# Altium schematic sheet PVDF_Drone.SchDoc
size A3; SheetNumber: 1; SheetTotal: 1
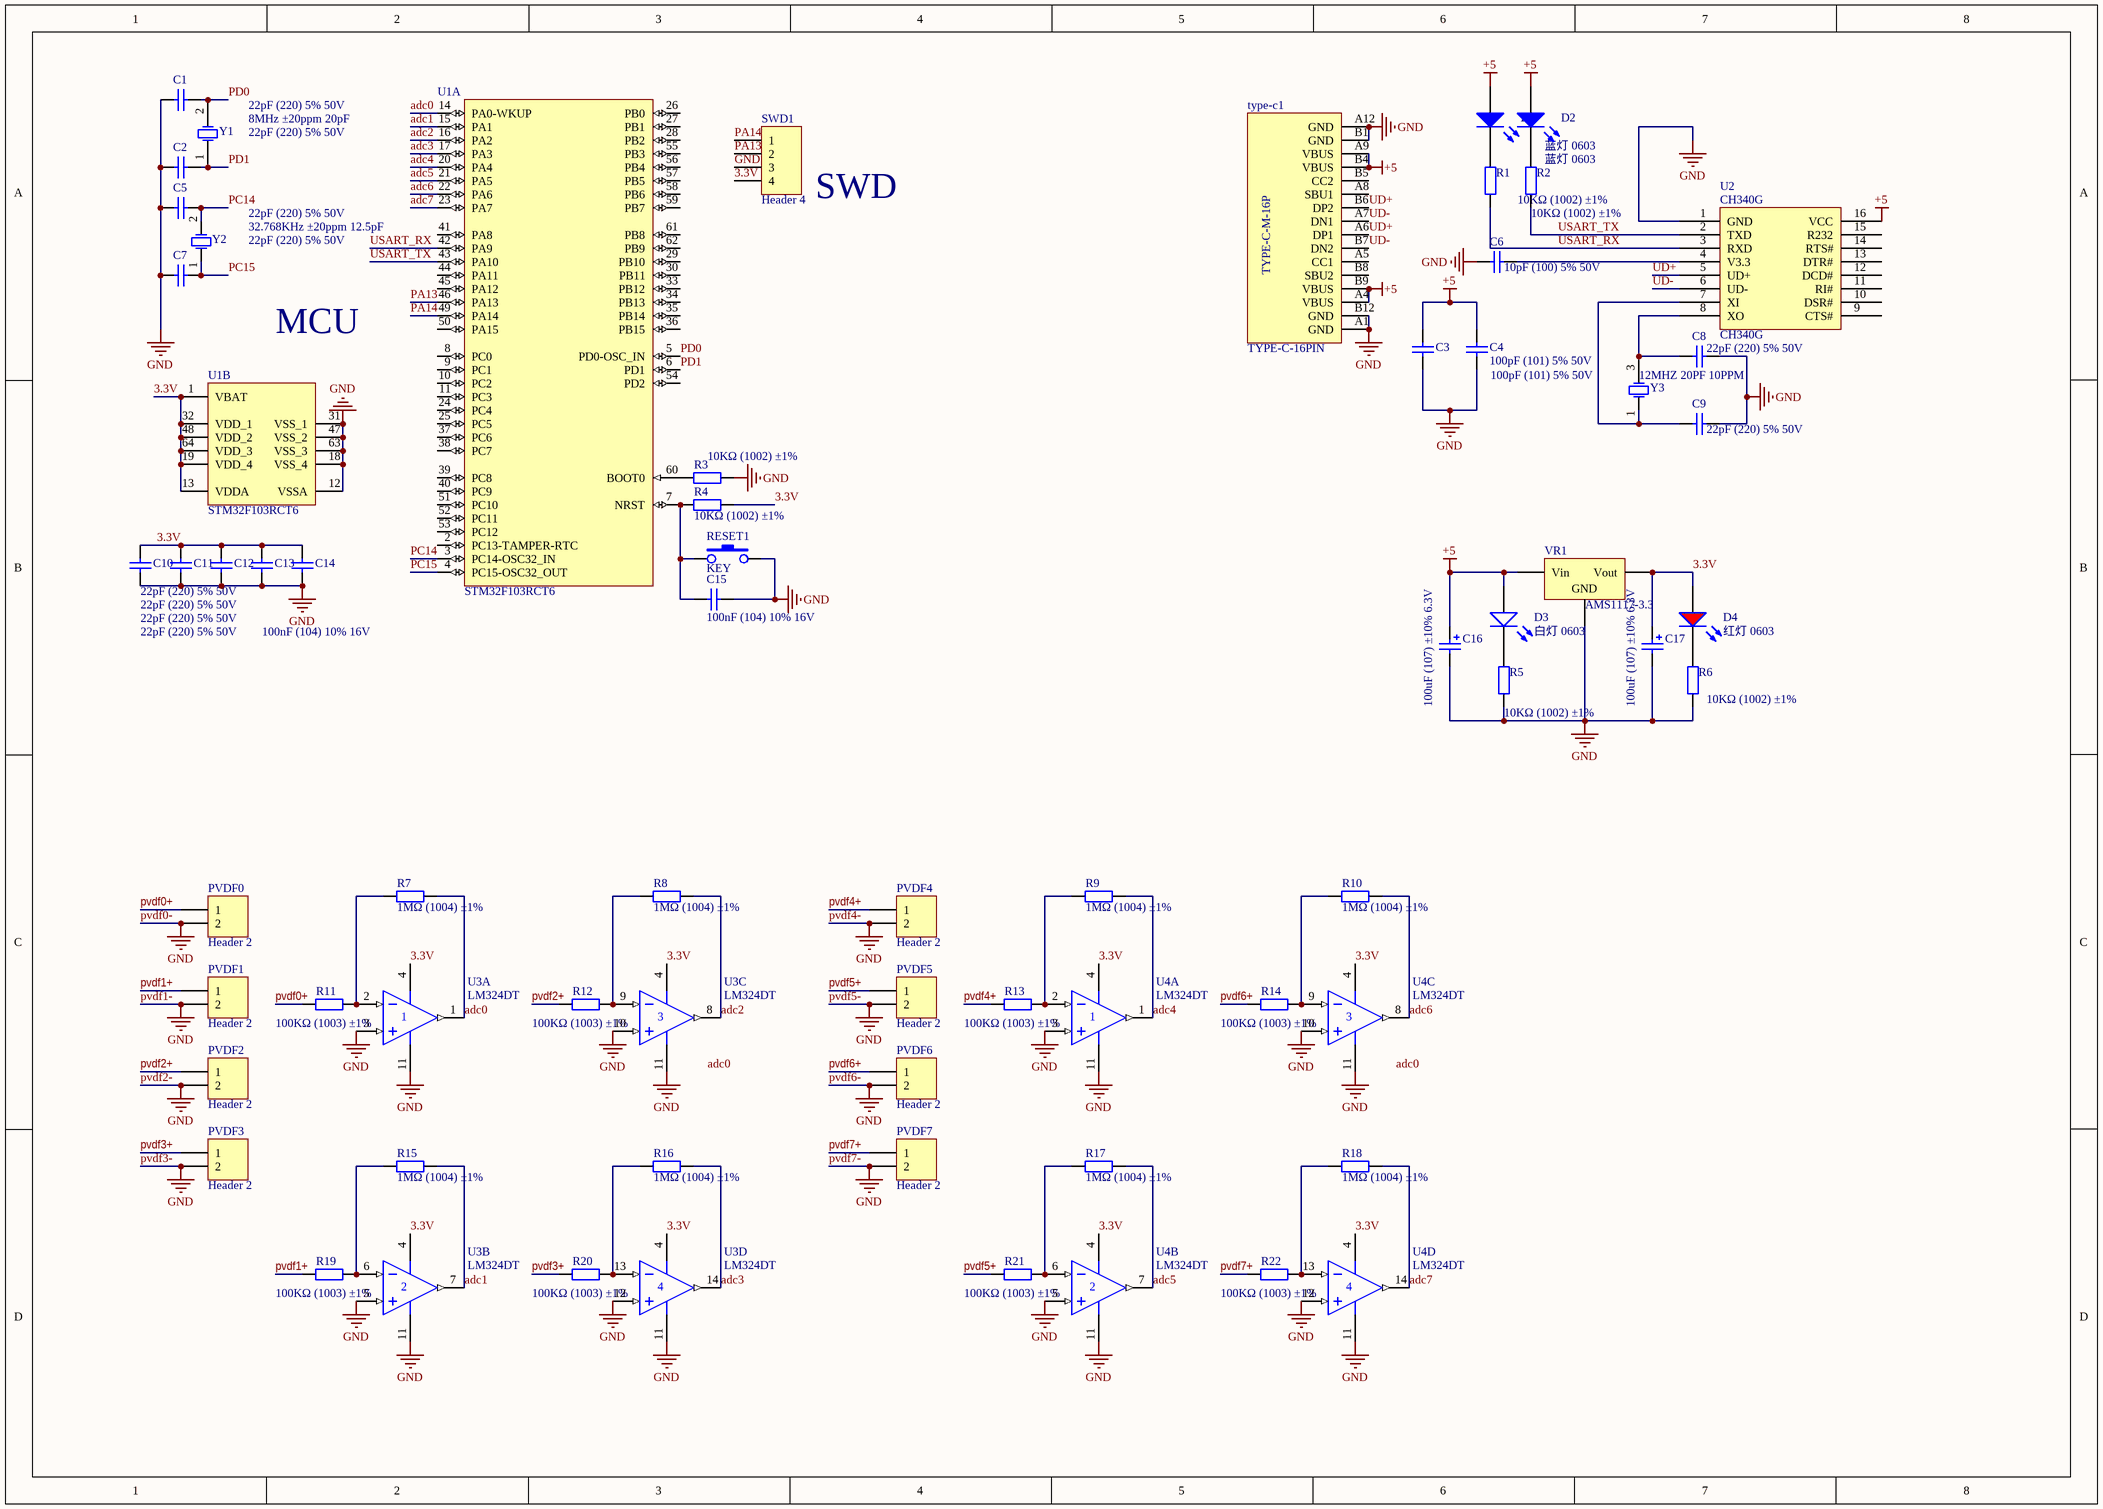
[diagram p0: PVDF_Drone.SchDoc]

## Parts
C1  22pF (220) 5% 50V  [0402_C]
C2  22pF (220) 5% 50V  [0402_C]
C3  100pF (101) 5% 50V  [0402_C]
C4  100pF (101) 5% 50V  [0402_C]
C5  22pF (220) 5% 50V  [0402_C]
C6  10pF (100) 5% 50V  [0402_C]
C7  22pF (220) 5% 50V  [0402_C]
C8  22pF (220) 5% 50V  [0402_C]
C9  22pF (220) 5% 50V  [0402_C]
C10  100nF (104) 10% 16V  [0402_C]
C11  22pF (220) 5% 50V  [0402_C]
C12  22pF (220) 5% 50V  [0402_C]
C13  22pF (220) 5% 50V  [0402_C]
C14  22pF (220) 5% 50V  [0402_C]
C15  100nF (104) 10% 16V  [0402_C]
C16  100uF (107) ±10% 6.3V  [CASE-B_3528]
C17  100uF (107) ±10% 6.3V  [CASE-B_3528]
D1  蓝灯 0603  [0603_LED_S1]
D2  蓝灯 0603  [0603_LED_S1]
D3  白灯 0603  [0603_LED_S1]
D4  红灯 0603  [0603_LED_S1]
PVDF0  Header 2  [Pin HDR1X2/2.54mm-S]
PVDF1  Header 2  [Pin HDR1X2/2.54mm-S]
PVDF2  Header 2  [Pin HDR1X2/2.54mm-S]
PVDF3  Header 2  [Pin HDR1X2/2.54mm-S]
PVDF4  Header 2  [Pin HDR1X2/2.54mm-S]
PVDF5  Header 2  [Pin HDR1X2/2.54mm-S]
PVDF6  Header 2  [Pin HDR1X2/2.54mm-S]
PVDF7  Header 2  [Pin HDR1X2/2.54mm-S]
R1  10KΩ (1002) ±1%  [0402_R]
R2  10KΩ (1002) ±1%  [0402_R]
R3  10KΩ (1002) ±1%  [0402_R]
R4  10KΩ (1002) ±1%  [0402_R]
R5  10KΩ (1002) ±1%  [0402_R]
R6  10KΩ (1002) ±1%  [0402_R]
R7  1MΩ (1004) ±1%  [0402_R]
R8  1MΩ (1004) ±1%  [0402_R]
R9  1MΩ (1004) ±1%  [0402_R]
R10  1MΩ (1004) ±1%  [0402_R]
R11  100KΩ (1003) ±1%  [0402_R]
R12  100KΩ (1003) ±1%  [0402_R]
R13  100KΩ (1003) ±1%  [0402_R]
R14  100KΩ (1003) ±1%  [0402_R]
R15  1MΩ (1004) ±1%  [0402_R]
R16  1MΩ (1004) ±1%  [0402_R]
R17  1MΩ (1004) ±1%  [0402_R]
R18  1MΩ (1004) ±1%  [0402_R]
R19  100KΩ (1003) ±1%  [0402_R]
R20  100KΩ (1003) ±1%  [0402_R]
R21  100KΩ (1003) ±1%  [0402_R]
R22  100KΩ (1003) ±1%  [0402_R]
RESET1  KEY  [SMD-3X6X2.5]
SWD1  Header 4  [Pin HDR1X4/2.54mm-S]
type-c1  TYPE-C-16PIN  [TYPE-C-M-16PIN]
U1  STM32F103RCT6  [LQFP-64_10x10x05P]  (parts A,B of 2)
U2  CH340G  [SOIC-16_150mil]
U3  LM324DT  [SOIC-14_150mil]  (parts A,B,C,D of 4)
U4  LM324DT  [SOIC-14_150mil]  (parts A,B,C,D of 4)
VR1  AMS1117-3.3  [SOT-223]
Y1  8MHz ±20ppm 20pF  [SMD-5032_2P]
Y2  32.768KHz ±20ppm 12.5pF  [SMD-3215_2P FC - 135]
Y3  12MHZ 20PF 10PPM  [SMD-3225_4P]

## Nets
+5: C3.2 C4.2 C16.1 D1.A D2.A D3.A type-c1.A4(VBUS) type-c1.A9(VBUS) type-c1.B4(VBUS) type-c1.B9(VBUS) U2.16(VCC) VR1.3(Vin)
GND: C1.1 C2.1 C3.1 C4.1 C5.1 C6.1 C7.1 C8.2 C9.2 C10.1 C11.1 C12.1 C13.1 C14.1 C15.1 C16.2 C17.2 PVDF0.2 PVDF1.2 PVDF2.2 PVDF3.2 PVDF4.2 PVDF5.2 PVDF6.2 PVDF7.2 R3.1 R5.1 R6.1 RESET1.3 SWD1.3 type-c1.A1(GND) type-c1.A12(GND) type-c1.B1(GND) type-c1.B12(GND) U1.12(VSSA) U1.18(VSS_4) U1.31(VSS_1) U1.47(VSS_2) U1.63(VSS_3) U2.1(GND) U3.3(IN+) U3.5(IN+) U3.10(IN+) U3.11(V-) U3.12(IN+) U4.3(IN+) U4.5(IN+) U4.10(IN+) U4.11(V-) U4.12(IN+) VR1.1(GND)  [also labelled pvdf0-, pvdf1-, pvdf2-, pvdf3-, pvdf4-, pvdf5-, pvdf6-, pvdf7-]
3.3V: C10.2 C11.2 C12.2 C13.2 C14.2 C17.1 D4.A R4.1 SWD1.4 U1.1(VBAT) U1.13(VDDA) U1.19(VDD_4) U1.32(VDD_1) U1.48(VDD_2) U1.64(VDD_3) U3.4(V+) U4.4(V+) VR1.2(Vout)
adc0: R7.2 U1.14(PA0-WKUP) U3.1(OUT)
adc1: R15.2 U1.15(PA1) U3.7(OUT)
adc2: R8.2 U1.16(PA2) U3.8(OUT)
adc3: R16.2 U1.17(PA3) U3.14(OUT)
adc4: R9.2 U1.20(PA4) U4.1(OUT)
adc5: R17.2 U1.21(PA5) U4.7(OUT)
adc6: R10.2 U1.22(PA6) U4.8(OUT)
adc7: R18.2 U1.23(PA7) U4.14(OUT)
PA13: SWD1.2 U1.46(PA13)
PA14: SWD1.1 U1.49(PA14)
PC14: C5.2 U1.3(PC14-OSC32_IN) Y2.2(OSC2)
PC15: C7.2 U1.4(PC15-OSC32_OUT) Y2.1(OSC1)
PD0: C1.2 U1.5(PD0-OSC_IN) Y1.2(OSC2)
PD1: C2.2 U1.6(PD1) Y1.1(OSC1)
pvdf0+: PVDF0.1 R11.1
pvdf1+: PVDF1.1 R19.1
pvdf2+: PVDF2.1 R12.1
pvdf3+: PVDF3.1 R20.1
pvdf4+: PVDF4.1 R13.1
pvdf5+: PVDF5.1 R21.1
pvdf6+: PVDF6.1 R14.1
pvdf7+: PVDF7.1 R22.1
UD+: type-c1.A6(DP1) type-c1.B6(DP2) U2.5(UD+)
UD-: type-c1.A7(DN1) type-c1.B7(DN2) U2.6(UD-)
USART_RX: R1.1 U1.42(PA9) U2.3(RXD)
USART_TX: R2.1 U1.43(PA10) U2.2(TXD)
NetC6_2: C6.2 U2.4(V3.3)
NetC8_1: C8.1 U2.8(XO) Y3.3(OSC2)
NetC9_1: C9.1 U2.7(XI) Y3.1(OSC1)
NetC15_2: C15.2 R4.2 RESET1.1 U1.7(NRST)
NetD1_K: D1.K R1.2
NetD2_K: D2.K R2.2
NetD3_K: D3.K R5.2
NetD4_K: D4.K R6.2
NetR3_2: R3.2 U1.60(BOOT0)
NetR7_1: R7.1 R11.2 U3.2(IN-)
NetR8_1: R8.1 R12.2 U3.9(IN-)
NetR9_1: R9.1 R13.2 U4.2(IN-)
NetR10_1: R10.1 R14.2 U4.9(IN-)
NetR15_1: R15.1 R19.2 U3.6(IN-)
NetR16_1: R16.1 R20.2 U3.13(IN-)
NetR17_1: R17.1 R21.2 U4.6(IN-)
NetR18_1: R18.1 R22.2 U4.13(IN-)

Not connected (* = marked no-connect by the designer): type-c1 A5(CC1) A8(SBU1) B5(CC2) B8(SBU2); U1 2(PC13-TAMPER-RTC) 8(PC0) 9(PC1) 10(PC2) 11(PC3) 24(PC4) 25(PC5) 26(PB0) 27(PB1) 28(PB2) 29(PB10) 30(PB11) 33(PB12) 34(PB13) 35(PB14) 36(PB15) 37(PC6) 38(PC7) 39(PC8) 40(PC9) 41(PA8) 44(PA11) 45(PA12) 50(PA15) 51(PC10) 52(PC11) 53(PC12) 54(PD2) 55(PB3) 56(PB4) 57(PB5) 58(PB6) 59(PB7) 61(PB8) 62(PB9); U2 9(CTS#) 10(DSR#) 11(RI#) 12(DCD#) 13(DTR#) 14(RTS#) 15(R232)

## Notes on the sheet
- SWD
- MCU
- Labels drawn without touching a wire or pin: adc0
- (in symbol TYPE-C-16PIN) TYPE-C-M-16P

## Library data of the parts
C1 C2 C5 C7-C9 C11-C14 = 0402 22pF (220) 5% 50V: 贴片电容; ComponentLink1Description: 供应商链接; ComponentLink1URL: http://www.szlcsc.com/product/details_1907.html; Package: 0402; Supplier: LC; SuppliersPartNumber: C1555
C3 C4 = 0402 100pF (101) 5% 50V: 贴片电容; ComponentLink1Description: 供应商链接; ComponentLink1URL: http://www.szlcsc.com/product/details_1898.html; Package: 0402; Supplier: LC; SuppliersPartNumber: C1546
C6 = 0402 10pF (100) 5% 50V: 贴片电容; ComponentLink1Description: 供应商链接; ComponentLink1URL: http://www.szlcsc.com/product/details_33914.html; Package: 0402; Supplier: LC; SuppliersPartNumber: C32949
C10 C15 = 0402 100nF (104) 10% 16V: 贴片电容; ComponentLink1Description: 供应商链接; ComponentLink1URL: http://www.szlcsc.com/product/details_1877.html; Package: 0402; Supplier: LC; SuppliersPartNumber: C1525
C16 C17 = 3528 100uF (107) 10% 6.3V: 钽电容; ComponentLink1Description: 供应商链接; ComponentLink1URL: http://www.szlcsc.com/product/details_16815.html; Package: 3528; Supplier: LC; SuppliersPartNumber: C16133
D1 D2 = 0603 蓝灯: 发光二极管; ComponentLink1Description: 供应商链接; ComponentLink1URL: http://www.szlcsc.com/product/details_73150.html; Package: 0603; Supplier: LC; SuppliersPartNumber: C72041
D3 = 0603 白灯: 发光二极管; ComponentLink1Description: 供应商链接; ComponentLink1URL: http://www.szlcsc.com/product/details_2663.html; Package: 0603; Supplier: LC; SuppliersPartNumber: C2290
D4 = 0603 红灯: 发光二极管; ComponentLink1Description: 供应商链接; ComponentLink1URL: http://www.szlcsc.com/product/details_2659.html; Package: 0603; Supplier: LC; SuppliersPartNumber: C2286
PVDF0-PVDF7 = Header 2: Header, 2-Pin; LatestRevisionDate: 17-Jul-2002; LatestRevisionNote: Re-released for DXP Platform.; Publisher: Altium Limited
R1-R6 = 0402 10KΩ (1002) 1%: 贴片电阻; ComponentLink1Description: 供应商链接; ComponentLink1URL: http://www.szlcsc.com/product/details_26487.html; Package: 0402; Supplier: LC; SuppliersPartNumber: C25744
R7-R10 R15-R18 = 0402 1MΩ (1004) 1%: 贴片电阻; ComponentLink1Description: 供应商链接; ComponentLink1URL: http://www.szlcsc.com/product/details_26826.html; Package: 0402; Supplier: LC; SuppliersPartNumber: C26083
R11-R14 R19-R22 = 0402 100KΩ (1003) 1%: 贴片电阻; ComponentLink1Description: 供应商链接; ComponentLink1URL: http://www.szlcsc.com/product/details_26484.html; Package: 0402; Supplier: LC; SuppliersPartNumber: C25741
SWD1 = Header 4: Header, 4-Pin; LatestRevisionDate: 17-Jul-2002; LatestRevisionNote: Re-released for DXP Platform.; Publisher: Altium Limited
U1 = STM32F103RCT6: ARM; ComponentLink1Description: 供应商链接; ComponentLink1URL: http://www.szlcsc.com/product/details_8815.html; Package: LQFP-64_10x10x05P; Supplier: LC; SuppliersPartNumber: C8323
U2 = CH340G_[C14267]: USB; ComponentLink1Description: 供应商链接; ComponentLink1URL: http://www.szlcsc.com/product/details_14927.html; Package: SOIC-16_150mil; Supplier: LC; SuppliersPartNumber: C14267
U3 U4 = LM324DT_[C71035]: 运放; ComponentLink1Description: 供应商链接; ComponentLink1URL: http://www.szlcsc.com/product/details_72134.html; Package: SOIC-14_150mil; Supplier: LC; SuppliersPartNumber: C71035
VR1 = SOT-223 AMS1117-3.3: 低压差线性稳压(LDO); ComponentLink1Description: 供应商链接; ComponentLink1URL: http://www.szlcsc.com/product/details_6652.html; Package: SOT-223; Supplier: LC; SuppliersPartNumber: C6186
Y1 = SMD-5032_2P 8MHz 20ppm 20pF: 贴片晶振; ComponentLink1Description: 供应商链接; ComponentLink1URL: http://www.szlcsc.com/product/details_117214.html; Package: SMD-5032_2P; Supplier: LC; SuppliersPartNumber: C115962
Y2 = SMD-3215_2P 32.768KHz 20ppm 12.5pF: 贴片晶振; ComponentLink1Description: 供应商链接; ComponentLink1URL: http://www.szlcsc.com/product/details_33310.html; Package: SMD-3215_2P; Supplier: LC; SuppliersPartNumber: C32346
Y3 = SMD-3225_4P  12MHZ 20PF 10PPM: 贴片晶振; ComponentLink1Description: 供应商链接; ComponentLink1URL: http://www.szlcsc.com/product/details_9522.html; Package: SMD-3225_4P; Supplier: LC; SuppliersPartNumber: C9002
type-c1 = TYPE-C-16PIN: LatestRevisionDate: 17-Jul-2002; LatestRevisionNote: Re-released for DXP Platform.; Publisher: Altium Limited